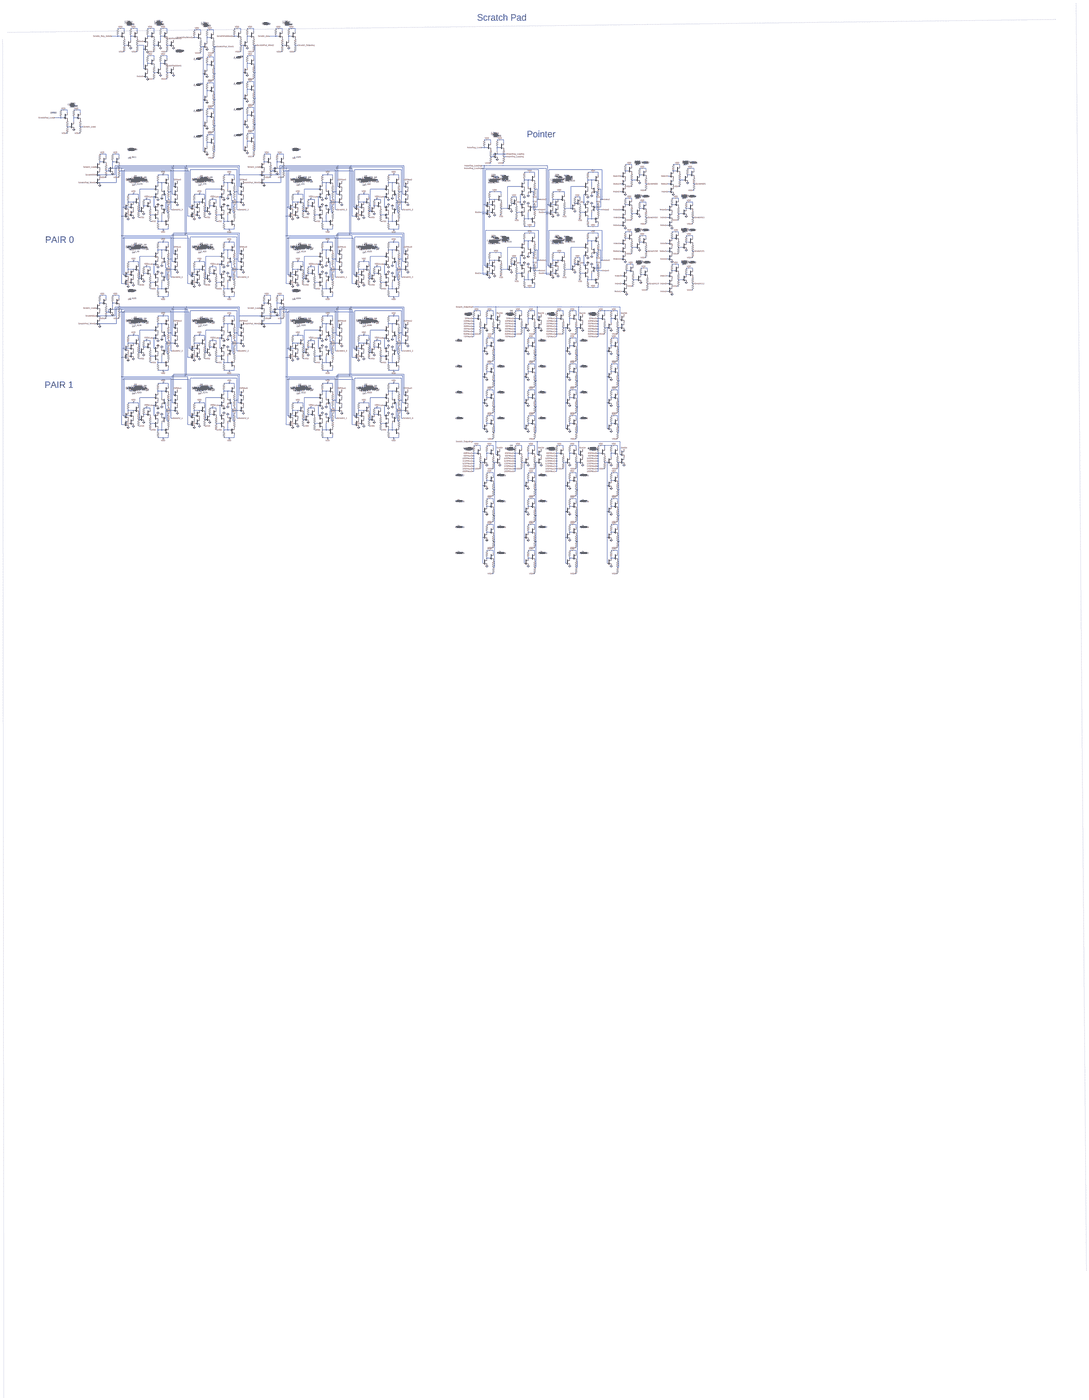
[diagram p0: schematic 4.asc, whole sheet]
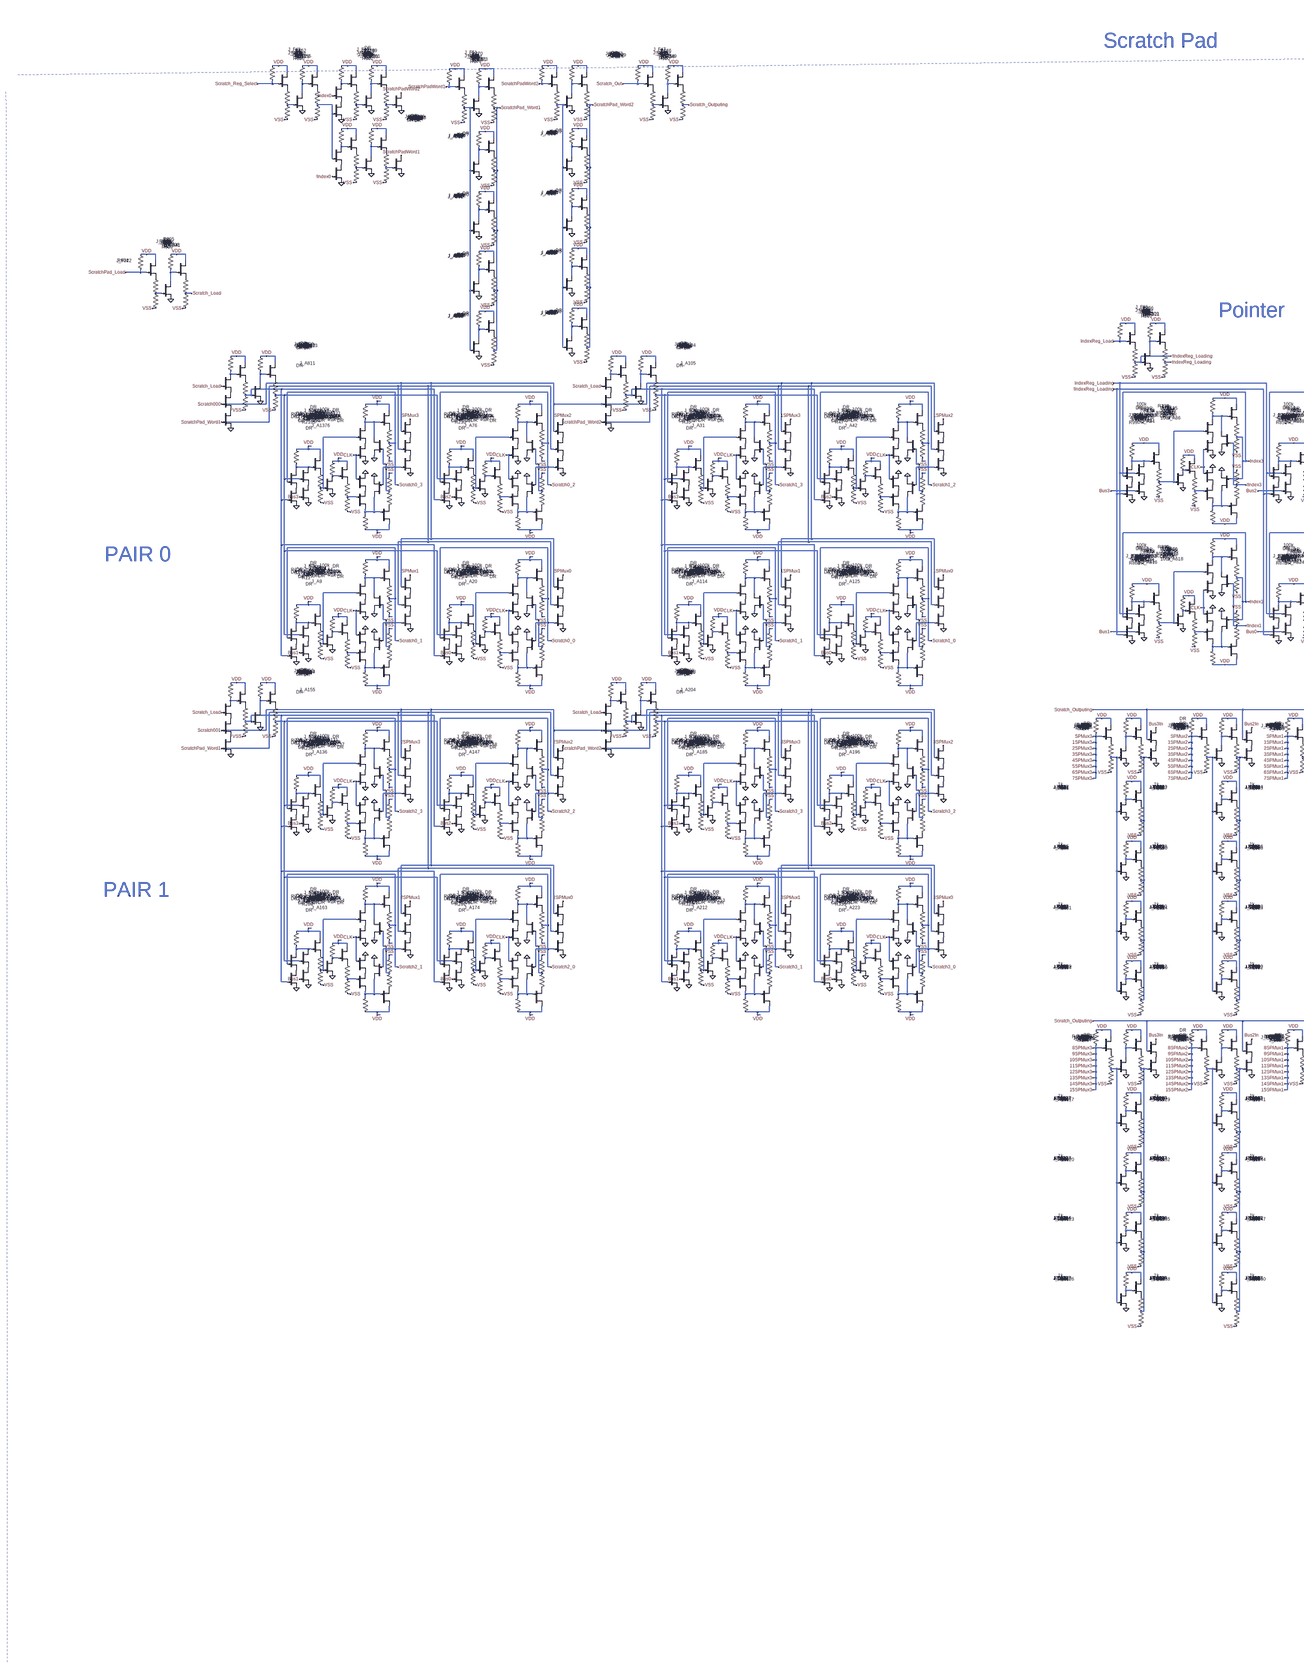
[diagram p1: schematic 4.asc, part, row 1 of 2, column 1 of 2]
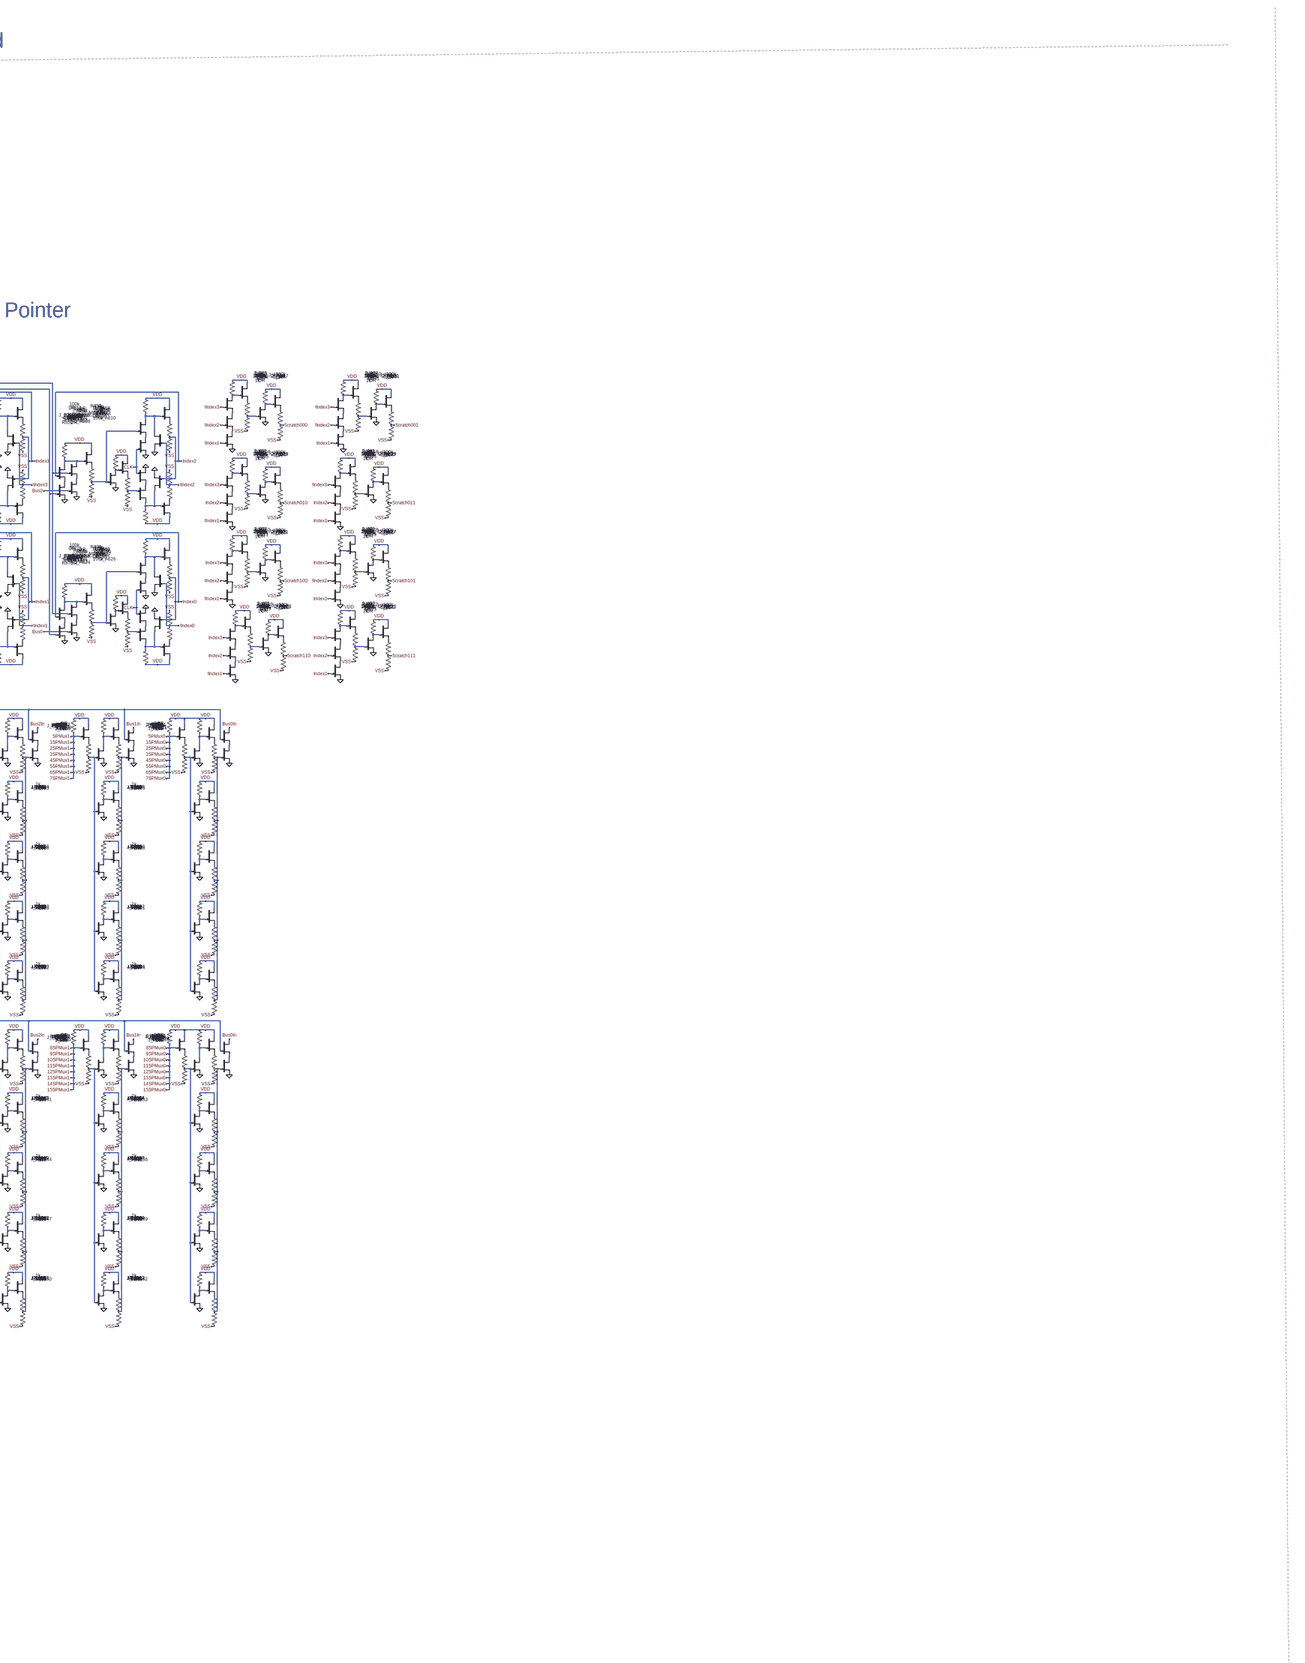
[diagram p2: schematic 4.asc, part, row 1 of 2, column 2 of 2]
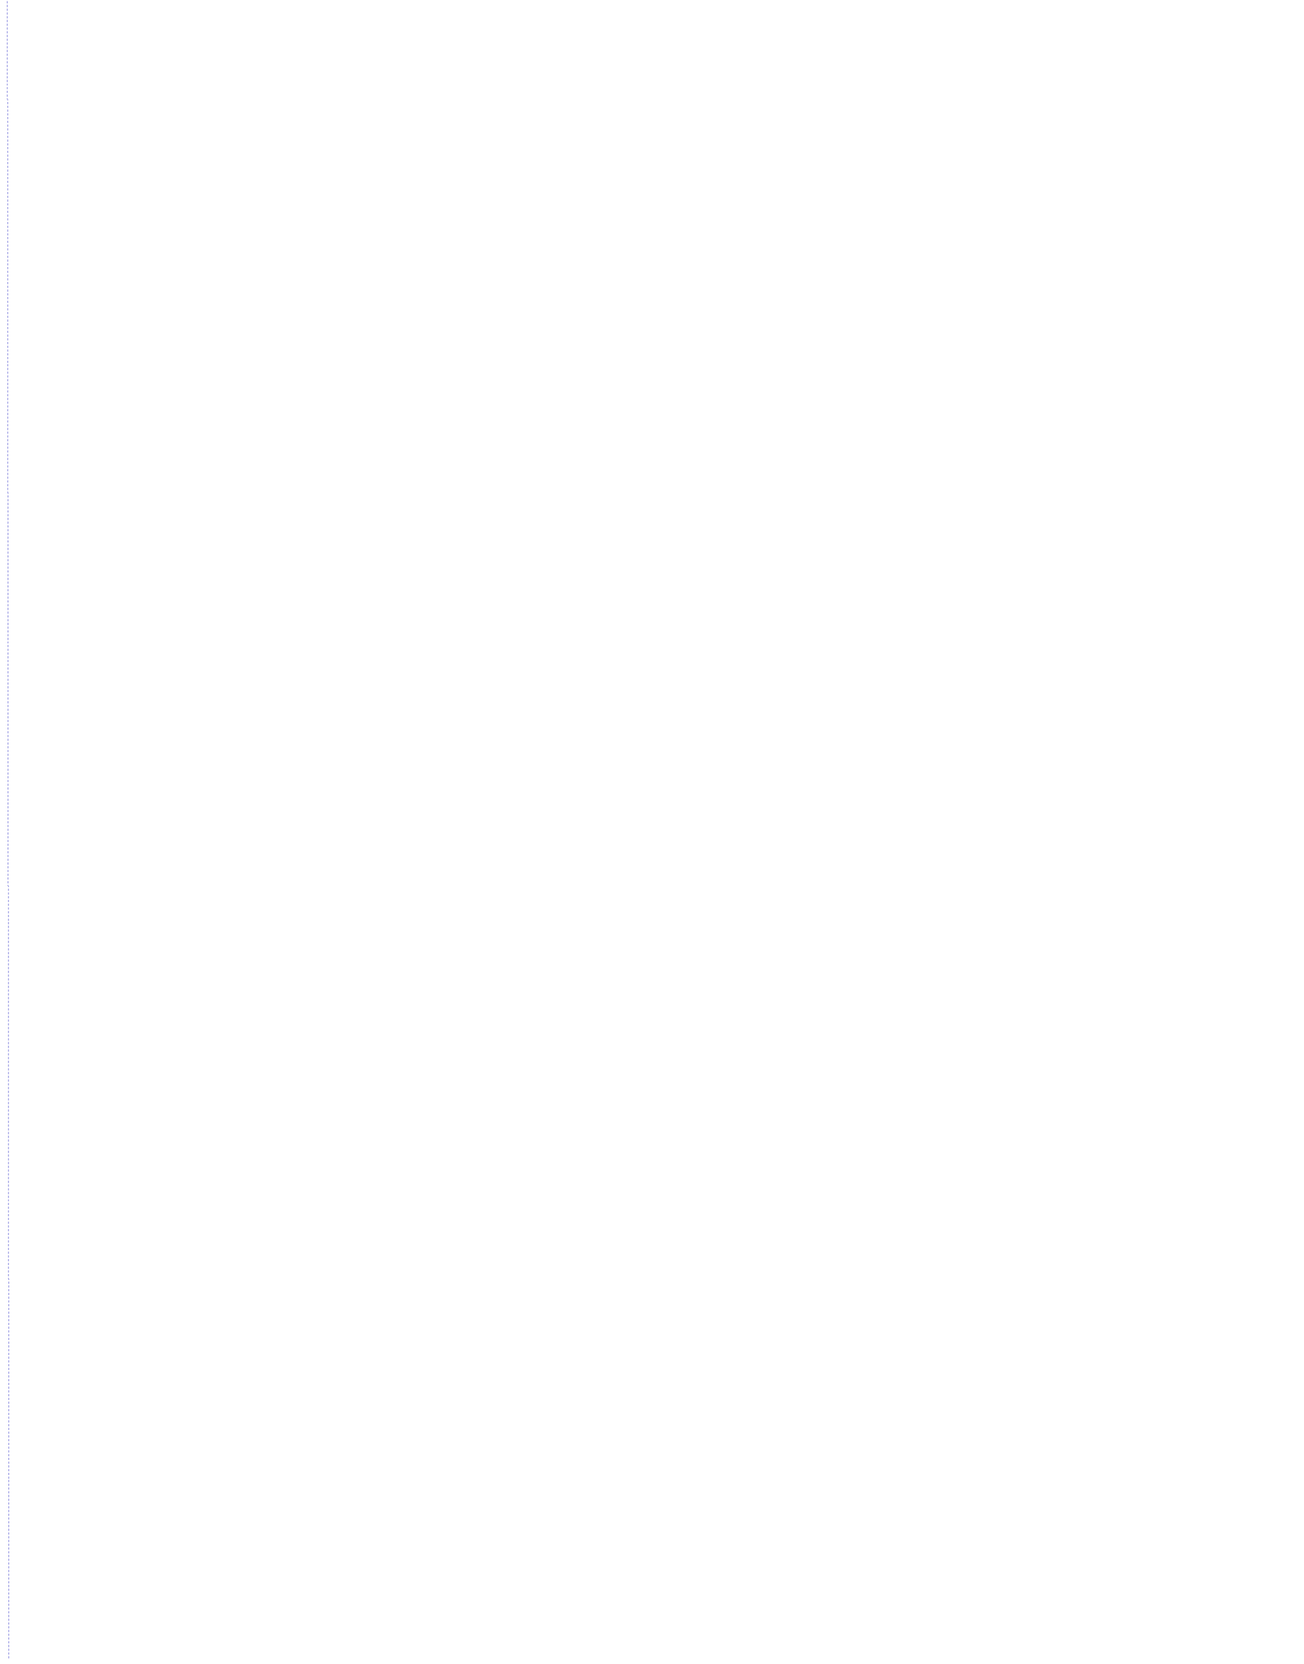
[diagram p3: schematic 4.asc, part, row 2 of 2, column 1 of 2]
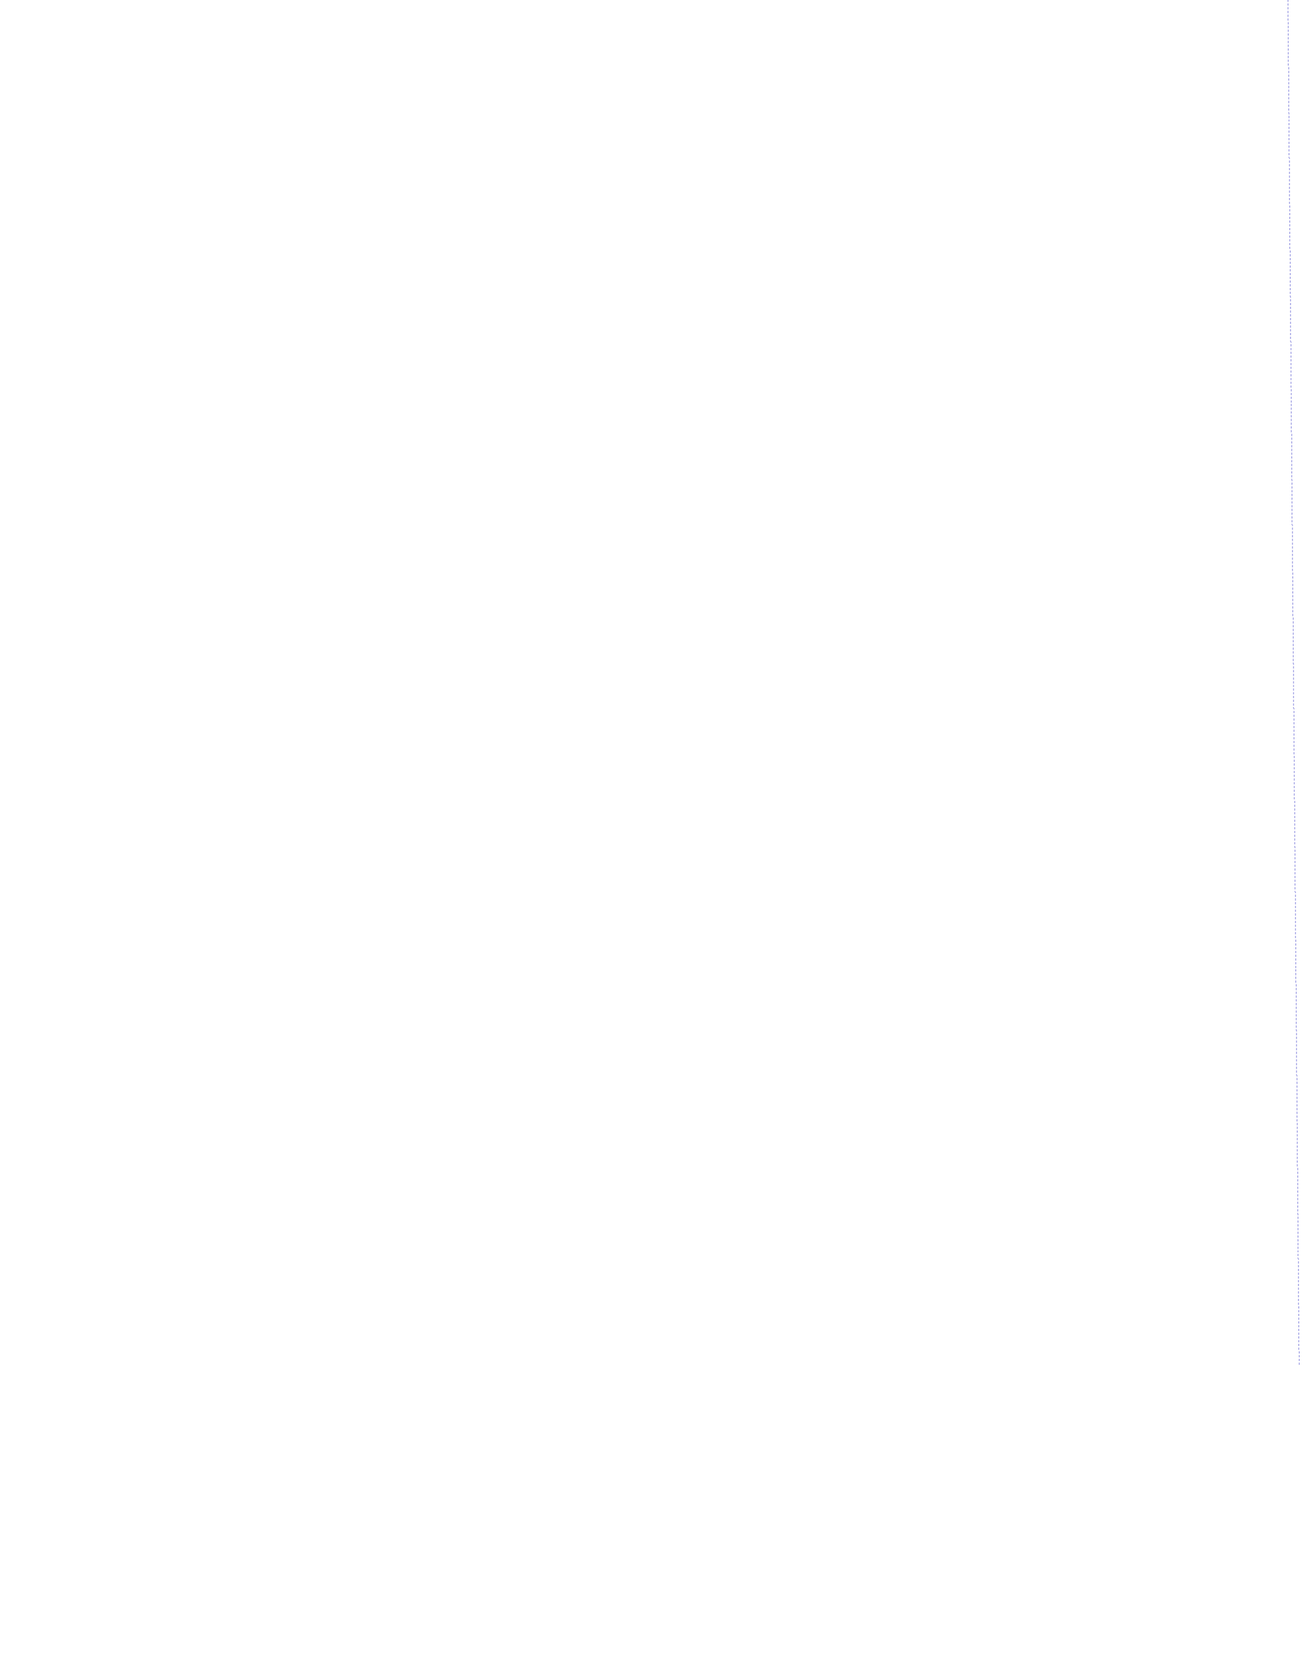
[diagram p4: schematic 4.asc, part, row 2 of 2, column 2 of 2]
* 4.asc
J_A1369 N045 N051 P001 DR
R2125 VDD N045 100k
J_F510 VDD N045 P002 DR
R2126 P002 Scratch0_3 1k
R2127 Scratch0_3 VSS 4.8k
J_B634 N045 N057 0 DR
J_A1370 N085 N079 P003 DR
R2128 VDD N085 100k
J_F511 VDD N085 P004 DR
R2129 P004 N057 1k
R2130 N057 VSS 4.8k
J_B635 N085 Scratch0_3 0 DR
J_A1371 P001 CLK 0 DR
J_A1372 P003 CLK 0 DR
J_A1373 N061 Scratch0_3 P005 DR
R2131 VDD N061 100k
J_F512 VDD N061 P006 DR
R2132 P006 N051 1k
R2133 N051 VSS 4.8k
J_B636 N061 N035 P007 DR
J_A1374 N069 N051 0 DR
R2134 VDD N069 50k
J_A1375 VDD N069 P008 DR
R2135 P008 N079 1k
R2136 N079 VSS 4.5k
J_A1376 P005 N033 0 DR
J_B637 P007 Bus3 0 DR
J_A64 P009 Scratch0_3 0 DR
J_A65 P010 ScratchPad_Word1 P009 DR
J_A66 7SPMux3 Scratch000 P010 DR
J_A1 N046 N052 P011 DR
R223 VDD N046 100k
J_F32 VDD N046 P012 DR
R224 P012 Scratch0_2 1k
R225 Scratch0_2 VSS 4.8k
J_B38 N046 N058 0 DR
J_A70 N086 N080 P013 DR
R226 VDD N086 100k
J_F64 VDD N086 P014 DR
R227 P014 N058 1k
R228 N058 VSS 4.8k
J_B39 N086 Scratch0_2 0 DR
J_A71 P011 CLK 0 DR
J_A72 P013 CLK 0 DR
J_A73 N062 Scratch0_2 P015 DR
R229 VDD N062 100k
J_F65 VDD N062 P016 DR
R230 P016 N052 1k
R231 N052 VSS 4.8k
J_B40 N062 N035 P017 DR
J_A74 N070 N052 0 DR
R232 VDD N070 50k
J_A75 VDD N070 P018 DR
R233 P018 N080 1k
R234 N080 VSS 4.5k
J_A76 P015 N033 0 DR
J_B41 P017 Bus2 0 DR
J_A77 P019 Scratch0_2 0 DR
J_A78 P020 ScratchPad_Word1 P019 DR
J_A286 7SPMux2 Scratch000 P020 DR
J_A48 N041 N049 P021 DR
R97 VDD N041 100k
J_F78 VDD N041 P022 DR
R98 P022 Index3 1k
R99 Index3 VSS 4.8k
J_B32 N041 !Index3 0 DR
J_A49 N083 N075 P023 DR
R100 VDD N083 100k
J_F79 VDD N083 P024 DR
R101 P024 !Index3 1k
R102 !Index3 VSS 4.8k
J_B33 N083 Index3 0 DR
J_A84 P021 CLK 0 DR
J_A85 P023 CLK 0 DR
J_A86 N055 Index3 P025 DR
R193 VDD N055 100k
J_F80 VDD N055 P026 DR
R194 P026 N049 1k
R195 N049 VSS 4.8k
J_B34 N055 IndexReg_Loading P027 DR
J_A87 N065 N049 0 DR
R196 VDD N065 50k
J_A92 VDD N065 P028 DR
R197 P028 N075 1k
R198 N075 VSS 4.5k
J_A93 P025 !IndexReg_Loading 0 DR
J_B35 P027 Bus3 0 DR
J_A606 N042 N050 P029 DR
R850 VDD N042 100k
J_F209 VDD N042 P030 DR
R851 P030 Index2 1k
R852 Index2 VSS 4.8k
J_B249 N042 !Index2 0 DR
J_A607 N084 N076 P031 DR
R853 VDD N084 100k
J_F210 VDD N084 P032 DR
R854 P032 !Index2 1k
R855 !Index2 VSS 4.8k
J_B250 N084 Index2 0 DR
J_A608 P029 CLK 0 DR
J_A609 P031 CLK 0 DR
J_A610 N056 Index2 P033 DR
R856 VDD N056 100k
J_F211 VDD N056 P034 DR
R857 P034 N050 1k
R858 N050 VSS 4.8k
J_B251 N056 IndexReg_Loading P035 DR
J_A611 N066 N050 0 DR
R859 VDD N066 50k
J_A612 VDD N066 P036 DR
R860 P036 N076 1k
R861 N076 VSS 4.5k
J_A613 P033 !IndexReg_Loading 0 DR
J_B252 P035 Bus2 0 DR
J_A614 N091 N095 P037 DR
R862 VDD N091 100k
J_F212 VDD N091 P038 DR
R863 P038 Index1 1k
R864 Index1 VSS 4.8k
J_B253 N091 !Index1 0 DR
J_A615 N129 N125 P039 DR
R865 VDD N129 100k
J_F213 VDD N129 P040 DR
R866 P040 !Index1 1k
R867 !Index1 VSS 4.8k
J_B254 N129 Index1 0 DR
J_A616 P037 CLK 0 DR
J_A617 P039 CLK 0 DR
J_A618 N107 Index1 P041 DR
R868 VDD N107 100k
J_F214 VDD N107 P042 DR
R869 P042 N095 1k
R870 N095 VSS 4.8k
J_B255 N107 IndexReg_Loading P043 DR
J_A619 N109 N095 0 DR
R871 VDD N109 50k
J_A620 VDD N109 P044 DR
R872 P044 N125 1k
R873 N125 VSS 4.5k
J_A621 P041 !IndexReg_Loading 0 DR
J_B256 P043 Bus1 0 DR
J_A622 N092 N096 P045 DR
R874 VDD N092 100k
J_F215 VDD N092 P046 DR
R875 P046 Index0 1k
R876 Index0 VSS 4.8k
J_B257 N092 !Index0 0 DR
J_A623 N130 N126 P047 DR
R877 VDD N130 100k
J_F216 VDD N130 P048 DR
R878 P048 !Index0 1k
R879 !Index0 VSS 4.8k
J_B258 N130 Index0 0 DR
J_A624 P045 CLK 0 DR
J_A625 P047 CLK 0 DR
J_A626 N108 Index0 P049 DR
R880 VDD N108 100k
J_F217 VDD N108 P050 DR
R881 P050 N096 1k
R882 N096 VSS 4.8k
J_B259 N108 IndexReg_Loading P051 DR
J_A627 N110 N096 0 DR
R883 VDD N110 50k
J_A628 VDD N110 P052 DR
R884 P052 N126 1k
R885 N126 VSS 4.5k
J_A629 P049 !IndexReg_Loading 0 DR
J_B260 P051 Bus0 0 DR
R904 VDD ScratchPad_Load 100k
J_F222 VDD ScratchPad_Load P053 DR
R905 P053 N025 1k
R906 N025 VSS 4.8k
J_A640 N024 N025 0 DR
R907 VDD N024 50k
J_A641 VDD N024 P054 DR
R908 P054 Scratch_Load 1k
R909 VSS Scratch_Load 4.5k
J_A44 N037 !Index3 P055 DR
R85 VDD N037 100k
J_F29 VDD N037 P056 DR
R86 P056 N043 1k
R87 N043 VSS 4.8k
J_B16 P055 !Index2 P057 DR
J_A45 N039 N043 0 DR
R88 VDD N039 50k
J_F30 VDD N039 P058 DR
R89 P058 Scratch000 1k
R90 VSS Scratch000 4.5k
J_B17 P057 !Index1 0 DR
J_A50 N067 !Index3 P059 DR
R103 VDD N067 100k
J_F33 VDD N067 P060 DR
R104 P060 N077 1k
R105 N077 VSS 4.8k
J_B18 P059 Index2 P061 DR
J_A51 N073 N077 0 DR
R106 VDD N073 50k
J_F34 VDD N073 P062 DR
R107 P062 Scratch010 1k
R108 VSS Scratch010 4.5k
J_B19 P061 !Index1 0 DR
J_A52 N089 Index3 P063 DR
R109 VDD N089 100k
J_F35 VDD N089 P064 DR
R110 P064 N097 1k
R111 N097 VSS 4.8k
J_B20 P063 !Index2 P065 DR
J_A53 N093 N097 0 DR
R112 VDD N093 50k
J_F36 VDD N093 P066 DR
R113 P066 Scratch100 1k
R114 VSS Scratch100 4.5k
J_B21 P065 !Index1 0 DR
J_A54 N119 Index3 P067 DR
R115 VDD N119 100k
J_F37 VDD N119 P068 DR
R116 P068 N131 1k
R117 N131 VSS 4.8k
J_B22 P067 Index2 P069 DR
J_A55 N127 N131 0 DR
R118 VDD N127 50k
J_F38 VDD N127 P070 DR
R119 P070 Scratch110 1k
R120 VSS Scratch110 4.5k
J_B23 P069 !Index1 0 DR
J_A56 N120 Index3 P071 DR
R121 VDD N120 100k
J_F39 VDD N120 P072 DR
R122 P072 N132 1k
R123 N132 VSS 4.8k
J_B24 P071 Index2 P073 DR
J_A57 N128 N132 0 DR
R124 VDD N128 50k
J_F40 VDD N128 P074 DR
R125 P074 Scratch111 1k
R126 VSS Scratch111 4.5k
J_B25 P073 Index1 0 DR
J_A58 N090 Index3 P075 DR
R127 VDD N090 100k
J_F41 VDD N090 P076 DR
R128 P076 N098 1k
R129 N098 VSS 4.8k
J_B26 P075 !Index2 P077 DR
J_A59 N094 N098 0 DR
R130 VDD N094 50k
J_F42 VDD N094 P078 DR
R131 P078 Scratch101 1k
R132 VSS Scratch101 4.5k
J_B27 P077 Index1 0 DR
J_A60 N068 !Index3 P079 DR
R133 VDD N068 100k
J_F43 VDD N068 P080 DR
R134 P080 N078 1k
R135 N078 VSS 4.8k
J_B28 P079 Index2 P081 DR
J_A61 N074 N078 0 DR
R136 VDD N074 50k
J_F44 VDD N074 P082 DR
R137 P082 Scratch011 1k
R138 VSS Scratch011 4.5k
J_B29 P081 Index1 0 DR
J_A62 N038 !Index3 P083 DR
R139 VDD N038 100k
J_F45 VDD N038 P084 DR
R140 P084 N044 1k
R141 N044 VSS 4.8k
J_B30 P083 !Index2 P085 DR
J_A63 N040 N044 0 DR
R142 VDD N040 50k
J_F46 VDD N040 P086 DR
R143 P086 Scratch001 1k
R144 VSS Scratch001 4.5k
J_B31 P085 Index1 0 DR
R145 VDD Scratch_Out 100k
J_F47 VDD Scratch_Out P087 DR
R146 P087 N012 1k
R147 N012 VSS 4.8k
J_A67 N005 N012 0 DR
R148 VDD N005 50k
J_A68 VDD N005 P088 DR
R149 P088 Scratch_Outputing 1k
R150 VSS Scratch_Outputing 4.5k
R151 VDD Scratch_Reg_Select 100k
J_F48 VDD Scratch_Reg_Select P089 DR
R152 P089 N007 1k
R153 N007 VSS 4.8k
J_A69 N001 N007 0 DR
R154 VDD N001 50k
J_A79 VDD N001 P090 DR
R155 P090 N008 1k
R156 VSS N008 4.5k
R157 VDD N002 100k
J_F49 VDD N002 P091 DR
R158 P091 N009 1k
R159 N009 VSS 4.8k
J_A82 N003 N009 0 DR
R160 VDD N003 50k
J_A83 VDD N003 P092 DR
R161 P092 N010 1k
R162 VSS N010 4.5k
J_A793 N002 Index0 P093 DR
J_A794 P093 N008 0 DR
R163 VDD N014 100k
J_F50 VDD N014 P094 DR
R164 P094 N018 1k
R165 N018 VSS 4.8k
J_A795 N015 N018 0 DR
R166 VDD N015 50k
J_A796 VDD N015 P095 DR
R167 P095 N019 1k
R168 VSS N019 4.5k
J_A797 N014 N008 P096 DR
J_A798 P096 !Index0 0 DR
J_A799 ScratchPadWord2 N010 0 DR
J_A800 ScratchPadWord1 N019 0 DR
R169 VDD ScratchPadWord1 100k
J_F51 VDD ScratchPadWord1 P097 DR
R170 P097 N013 1k
R171 N013 VSS 4.8k
J_A80 N006 N013 0 DR
R172 VDD N006 50k
J_A81 VDD N006 P098 DR
R173 P098 ScratchPad_Word1 1k
R174 VSS ScratchPad_Word1 4.5k
R175 VDD ScratchPadWord2 100k
J_F52 VDD ScratchPadWord2 P099 DR
R176 P099 N011 1k
R177 N011 VSS 4.8k
J_A96 N004 N011 0 DR
R178 VDD N004 50k
J_A97 VDD N004 P100 DR
R179 P100 ScratchPad_Word2 1k
R180 VSS ScratchPad_Word2 4.5k
R205 VDD IndexReg_Load 100k
J_F86 VDD IndexReg_Load P101 DR
R206 P101 !IndexReg_Loading 1k
R207 !IndexReg_Loading VSS 4.8k
J_A102 N028 !IndexReg_Loading 0 DR
R208 VDD N028 50k
J_A111 VDD N028 P102 DR
R209 P102 IndexReg_Loading 1k
R210 VSS IndexReg_Loading 4.5k
R200 VDD 7SPMux3 100k
J_F58 VDD 7SPMux3 P103 DR
R201 P103 N157 1k
R203 N157 VSS 4.8k
J_A100 N149 N157 0 DR
R204 VDD N149 50k
J_A101 VDD N149 P104 DR
R211 P104 N158 1k
R212 VSS N158 4.5k
J_F59 P105 N158 0 DR
R213 VDD 7SPMux2 100k
J_F60 VDD 7SPMux2 P106 DR
R214 P106 N159 1k
R215 N159 VSS 4.8k
J_A280 N150 N159 0 DR
R216 VDD N150 50k
J_A281 VDD N150 P107 DR
R217 P107 N160 1k
R218 VSS N160 4.5k
J_F61 P108 N160 0 DR
R219 VDD 7SPMux1 100k
J_F62 VDD 7SPMux1 P109 DR
R220 P109 N161 1k
R221 N161 VSS 4.8k
J_A282 N151 N161 0 DR
R222 VDD N151 50k
J_A283 VDD N151 P110 DR
R898 P110 N162 1k
R899 VSS N162 4.5k
J_F63 P111 N162 0 DR
R900 VDD 7SPMux0 100k
J_F71 VDD 7SPMux0 P112 DR
R901 P112 N163 1k
R902 N163 VSS 4.8k
J_A284 N152 N163 0 DR
R903 VDD N152 50k
J_A285 VDD N152 P113 DR
R911 P113 N164 1k
R912 VSS N164 4.5k
J_F82 P114 N164 0 DR
J_F266 Bus3In Scratch_Outputing P105 DR
J_F267 Bus2In Scratch_Outputing P108 DR
J_F268 Bus1In Scratch_Outputing P111 DR
J_F269 Bus0In Scratch_Outputing P114 DR
R199 VDD N029 100k
J_F270 VDD N029 P115 DR
R202 P115 N033 1k
R910 N033 VSS 4.8k
J_A807 N030 N033 0 DR
R913 VDD N030 50k
J_A808 VDD N030 P116 DR
R1023 P116 N035 1k
R1024 VSS N035 4.5k
J_A809 N029 Scratch_Load P117 DR
J_A810 P117 Scratch000 P118 DR
J_A811 P118 ScratchPad_Word1 0 DR
J_A2 N099 N103 P119 DR
R1 VDD N099 100k
J_F1 VDD N099 P120 DR
R2 P120 Scratch0_1 1k
R3 Scratch0_1 VSS 4.8k
J_B1 N099 N111 0 DR
J_A3 N137 N133 P121 DR
R4 VDD N137 100k
J_F2 VDD N137 P122 DR
R5 P122 N111 1k
R6 N111 VSS 4.8k
J_B2 N137 Scratch0_1 0 DR
J_A4 P119 CLK 0 DR
J_A5 P121 CLK 0 DR
J_A6 N115 Scratch0_1 P123 DR
R7 VDD N115 100k
J_F3 VDD N115 P124 DR
R8 P124 N103 1k
R9 N103 VSS 4.8k
J_B3 N115 N035 P125 DR
J_A7 N121 N103 0 DR
R10 VDD N121 50k
J_A8 VDD N121 P126 DR
R11 P126 N133 1k
R12 N133 VSS 4.5k
J_A9 P123 N033 0 DR
J_B4 P125 Bus1 0 DR
J_A10 P127 Scratch0_1 0 DR
J_A11 P128 ScratchPad_Word1 P127 DR
J_A12 7SPMux1 Scratch000 P128 DR
J_A13 N100 N104 P129 DR
R13 VDD N100 100k
J_F4 VDD N100 P130 DR
R14 P130 Scratch0_0 1k
R15 Scratch0_0 VSS 4.8k
J_B5 N100 N112 0 DR
J_A14 N138 N134 P131 DR
R16 VDD N138 100k
J_F5 VDD N138 P132 DR
R17 P132 N112 1k
R18 N112 VSS 4.8k
J_B6 N138 Scratch0_0 0 DR
J_A15 P129 CLK 0 DR
J_A16 P131 CLK 0 DR
J_A17 N116 Scratch0_0 P133 DR
R19 VDD N116 100k
J_F6 VDD N116 P134 DR
R20 P134 N104 1k
R21 N104 VSS 4.8k
J_B7 N116 N035 P135 DR
J_A18 N122 N104 0 DR
R22 VDD N122 50k
J_A19 VDD N122 P136 DR
R23 P136 N134 1k
R24 N134 VSS 4.5k
J_A20 P133 N033 0 DR
J_B8 P135 Bus0 0 DR
J_A21 P137 Scratch0_0 0 DR
J_A22 P138 ScratchPad_Word1 P137 DR
J_A23 7SPMux0 Scratch000 P138 DR
J_A24 N047 N053 P139 DR
R25 VDD N047 100k
J_F7 VDD N047 P140 DR
R26 P140 Scratch1_3 1k
R27 Scratch1_3 VSS 4.8k
J_B9 N047 N059 0 DR
J_A25 N087 N081 P141 DR
R28 VDD N087 100k
J_F8 VDD N087 P142 DR
R29 P142 N059 1k
R30 N059 VSS 4.8k
J_B10 N087 Scratch1_3 0 DR
J_A26 P139 CLK 0 DR
J_A27 P141 CLK 0 DR
J_A28 N063 Scratch1_3 P143 DR
R31 VDD N063 100k
J_F9 VDD N063 P144 DR
R32 P144 N053 1k
R33 N053 VSS 4.8k
J_B11 N063 N036 P145 DR
J_A29 N071 N053 0 DR
R34 VDD N071 50k
J_A30 VDD N071 P146 DR
R35 P146 N081 1k
R36 N081 VSS 4.5k
J_A31 P143 N034 0 DR
J_B12 P145 Bus3 0 DR
J_A32 P147 Scratch1_3 0 DR
J_A33 P148 ScratchPad_Word2 P147 DR
J_A34 7SPMux3 Scratch000 P148 DR
J_A35 N048 N054 P149 DR
R37 VDD N048 100k
J_F10 VDD N048 P150 DR
R38 P150 Scratch1_2 1k
R39 Scratch1_2 VSS 4.8k
J_B13 N048 N060 0 DR
J_A36 N088 N082 P151 DR
R40 VDD N088 100k
J_F11 VDD N088 P152 DR
R41 P152 N060 1k
R42 N060 VSS 4.8k
J_B14 N088 Scratch1_2 0 DR
J_A37 P149 CLK 0 DR
J_A38 P151 CLK 0 DR
J_A39 N064 Scratch1_2 P153 DR
R43 VDD N064 100k
J_F12 VDD N064 P154 DR
R44 P154 N054 1k
R45 N054 VSS 4.8k
J_B15 N064 N036 P155 DR
J_A40 N072 N054 0 DR
R46 VDD N072 50k
J_A41 VDD N072 P156 DR
R47 P156 N082 1k
R48 N082 VSS 4.5k
J_A42 P153 N034 0 DR
J_B36 P155 Bus2 0 DR
J_A43 P157 Scratch1_2 0 DR
J_A88 P158 ScratchPad_Word2 P157 DR
J_A89 7SPMux2 Scratch000 P158 DR
R49 VDD N031 100k
J_F13 VDD N031 P159 DR
R50 P159 N034 1k
R51 N034 VSS 4.8k
J_A90 N032 N034 0 DR
R52 VDD N032 50k
J_A91 VDD N032 P160 DR
R53 P160 N036 1k
R54 VSS N036 4.5k
J_A103 N031 Scratch_Load P161 DR
J_A104 P161 Scratch000 P162 DR
J_A105 P162 ScratchPad_Word2 0 DR
J_A106 N101 N105 P163 DR
R55 VDD N101 100k
J_F14 VDD N101 P164 DR
R56 P164 Scratch1_1 1k
R57 Scratch1_1 VSS 4.8k
J_B37 N101 N113 0 DR
J_A107 N139 N135 P165 DR
R58 VDD N139 100k
J_F15 VDD N139 P166 DR
R59 P166 N113 1k
R60 N113 VSS 4.8k
J_B42 N139 Scratch1_1 0 DR
J_A108 P163 CLK 0 DR
J_A109 P165 CLK 0 DR
J_A110 N117 Scratch1_1 P167 DR
R61 VDD N117 100k
J_F16 VDD N117 P168 DR
R62 P168 N105 1k
R63 N105 VSS 4.8k
J_B43 N117 N036 P169 DR
J_A112 N123 N105 0 DR
R64 VDD N123 50k
J_A113 VDD N123 P170 DR
R65 P170 N135 1k
R66 N135 VSS 4.5k
J_A114 P167 N034 0 DR
J_B44 P169 Bus1 0 DR
J_A115 P171 Scratch1_1 0 DR
J_A116 P172 ScratchPad_Word2 P171 DR
J_A117 7SPMux1 Scratch000 P172 DR
J_A118 N102 N106 P173 DR
R67 VDD N102 100k
J_F17 VDD N102 P174 DR
R68 P174 Scratch1_0 1k
R69 Scratch1_0 VSS 4.8k
J_B45 N102 N114 0 DR
J_A119 N140 N136 P175 DR
R70 VDD N140 100k
J_F18 VDD N140 P176 DR
R71 P176 N114 1k
R72 N114 VSS 4.8k
J_B46 N140 Scratch1_0 0 DR
J_A120 P173 CLK 0 DR
J_A121 P175 CLK 0 DR
J_A122 N118 Scratch1_0 P177 DR
R73 VDD N118 100k
J_F19 VDD N118 P178 DR
R74 P178 N106 1k
R75 N106 VSS 4.8k
J_B47 N118 N036 P179 DR
J_A123 N124 N106 0 DR
R76 VDD N124 50k
J_A124 VDD N124 P180 DR
R77 P180 N136 1k
R78 N136 VSS 4.5k
J_A125 P177 N034 0 DR
J_B48 P179 Bus0 0 DR
J_A126 P181 Scratch1_0 0 DR
J_A127 P182 ScratchPad_Word2 P181 DR
J_A128 7SPMux0 Scratch000 P182 DR
J_A129 N153 N165 P183 DR
R79 VDD N153 100k
J_F20 VDD N153 P184 DR
R80 P184 Scratch2_3 1k
R81 Scratch2_3 VSS 4.8k
J_B49 N153 N169 0 DR
J_A130 N189 N185 P185 DR
R82 VDD N189 100k
J_F21 VDD N189 P186 DR
R83 P186 N169 1k
R84 N169 VSS 4.8k
J_B50 N189 Scratch2_3 0 DR
J_A131 P183 CLK 0 DR
J_A132 P185 CLK 0 DR
J_A133 N173 Scratch2_3 P187 DR
R235 VDD N173 100k
J_F22 VDD N173 P188 DR
R236 P188 N165 1k
R237 N165 VSS 4.8k
J_B51 N173 N147 P189 DR
J_A134 N181 N165 0 DR
R238 VDD N181 50k
J_A135 VDD N181 P190 DR
R239 P190 N185 1k
R240 N185 VSS 4.5k
J_A136 P187 N145 0 DR
J_B52 P189 Bus3 0 DR
J_A137 P191 Scratch2_3 0 DR
J_A138 P192 ScratchPad_Word1 P191 DR
J_A139 7SPMux3 Scratch001 P192 DR
J_A140 N154 N166 P193 DR
R241 VDD N154 100k
J_F23 VDD N154 P194 DR
R242 P194 Scratch2_2 1k
R243 Scratch2_2 VSS 4.8k
J_B53 N154 N170 0 DR
J_A141 N190 N186 P195 DR
R244 VDD N190 100k
J_F24 VDD N190 P196 DR
R245 P196 N170 1k
R246 N170 VSS 4.8k
J_B54 N190 Scratch2_2 0 DR
J_A142 P193 CLK 0 DR
J_A143 P195 CLK 0 DR
J_A144 N174 Scratch2_2 P197 DR
R247 VDD N174 100k
J_F25 VDD N174 P198 DR
R248 P198 N166 1k
R249 N166 VSS 4.8k
J_B55 N174 N147 P199 DR
J_A145 N182 N166 0 DR
R250 VDD N182 50k
J_A146 VDD N182 P200 DR
R251 P200 N186 1k
R252 N186 VSS 4.5k
J_A147 P197 N145 0 DR
J_B56 P199 Bus2 0 DR
J_A148 P201 Scratch2_2 0 DR
J_A149 P202 ScratchPad_Word1 P201 DR
J_A150 7SPMux2 Scratch001 P202 DR
R253 VDD N141 100k
J_F26 VDD N141 P203 DR
R254 P203 N145 1k
R255 N145 VSS 4.8k
J_A151 N142 N145 0 DR
R256 VDD N142 50k
J_A152 VDD N142 P204 DR
R257 P204 N147 1k
R258 VSS N147 4.5k
J_A153 N141 Scratch_Load P205 DR
J_A154 P205 Scratch001 P206 DR
J_A155 P206 ScratchPad_Word1 0 DR
J_A156 N197 N201 P207 DR
R259 VDD N197 100k
J_F27 VDD N197 P208 DR
R260 P208 Scratch2_1 1k
R261 Scratch2_1 VSS 4.8k
J_B57 N197 N209 0 DR
J_A157 N229 N221 P209 DR
R262 VDD N229 100k
J_F28 VDD N229 P210 DR
R263 P210 N209 1k
R264 N209 VSS 4.8k
J_B58 N229 Scratch2_1 0 DR
J_A158 P207 CLK 0 DR
J_A159 P209 CLK 0 DR
J_A160 N213 Scratch2_1 P211 DR
R265 VDD N213 100k
J_F66 VDD N213 P212 DR
R266 P212 N201 1k
R267 N201 VSS 4.8k
J_B59 N213 N147 P213 DR
J_A161 N217 N201 0 DR
R268 VDD N217 50k
J_A162 VDD N217 P214 DR
R269 P214 N221 1k
R270 N221 VSS 4.5k
J_A163 P211 N145 0 DR
J_B60 P213 Bus1 0 DR
J_A164 P215 Scratch2_1 0 DR
J_A165 P216 ScratchPad_Word1 P215 DR
J_A166 7SPMux1 Scratch001 P216 DR
J_A167 N198 N202 P217 DR
R271 VDD N198 100k
J_F67 VDD N198 P218 DR
R272 P218 Scratch2_0 1k
R273 Scratch2_0 VSS 4.8k
J_B61 N198 N210 0 DR
J_A168 N230 N222 P219 DR
R274 VDD N230 100k
J_F68 VDD N230 P220 DR
R275 P220 N210 1k
R276 N210 VSS 4.8k
J_B62 N230 Scratch2_0 0 DR
J_A169 P217 CLK 0 DR
J_A170 P219 CLK 0 DR
J_A171 N214 Scratch2_0 P221 DR
R277 VDD N214 100k
J_F69 VDD N214 P222 DR
R278 P222 N202 1k
R279 N202 VSS 4.8k
J_B63 N214 N147 P223 DR
J_A172 N218 N202 0 DR
R280 VDD N218 50k
J_A173 VDD N218 P224 DR
R281 P224 N222 1k
R282 N222 VSS 4.5k
J_A174 P221 N145 0 DR
J_B64 P223 Bus0 0 DR
J_A175 P225 Scratch2_0 0 DR
J_A176 P226 ScratchPad_Word1 P225 DR
J_A177 7SPMux0 Scratch001 P226 DR
J_A178 N155 N167 P227 DR
R283 VDD N155 100k
J_F70 VDD N155 P228 DR
R284 P228 Scratch3_3 1k
R285 Scratch3_3 VSS 4.8k
J_B65 N155 N171 0 DR
J_A179 N191 N187 P229 DR
R286 VDD N191 100k
J_F72 VDD N191 P230 DR
R287 P230 N171 1k
R288 N171 VSS 4.8k
J_B66 N191 Scratch3_3 0 DR
J_A180 P227 CLK 0 DR
J_A181 P229 CLK 0 DR
J_A182 N175 Scratch3_3 P231 DR
R289 VDD N175 100k
J_F73 VDD N175 P232 DR
R290 P232 N167 1k
R291 N167 VSS 4.8k
J_B67 N175 N148 P233 DR
J_A183 N183 N167 0 DR
R292 VDD N183 50k
J_A184 VDD N183 P234 DR
R293 P234 N187 1k
R294 N187 VSS 4.5k
J_A185 P231 N146 0 DR
J_B68 P233 Bus3 0 DR
J_A186 P235 Scratch3_3 0 DR
J_A187 P236 ScratchPad_Word2 P235 DR
J_A188 7SPMux3 Scratch001 P236 DR
J_A189 N156 N168 P237 DR
R295 VDD N156 100k
J_F74 VDD N156 P238 DR
R296 P238 Scratch3_2 1k
R297 Scratch3_2 VSS 4.8k
J_B69 N156 N172 0 DR
J_A190 N192 N188 P239 DR
R298 VDD N192 100k
J_F75 VDD N192 P240 DR
R299 P240 N172 1k
R300 N172 VSS 4.8k
J_B70 N192 Scratch3_2 0 DR
J_A191 P237 CLK 0 DR
J_A192 P239 CLK 0 DR
J_A193 N176 Scratch3_2 P241 DR
R301 VDD N176 100k
J_F76 VDD N176 P242 DR
R302 P242 N168 1k
R303 N168 VSS 4.8k
J_B71 N176 N148 P243 DR
J_A194 N184 N168 0 DR
R304 VDD N184 50k
J_A195 VDD N184 P244 DR
R305 P244 N188 1k
R306 N188 VSS 4.5k
J_A196 P241 N146 0 DR
J_B72 P243 Bus2 0 DR
J_A197 P245 Scratch3_2 0 DR
J_A198 P246 ScratchPad_Word2 P245 DR
J_A199 7SPMux2 Scratch001 P246 DR
R307 VDD N143 100k
J_F77 VDD N143 P247 DR
R308 P247 N146 1k
R309 N146 VSS 4.8k
J_A200 N144 N146 0 DR
R310 VDD N144 50k
J_A201 VDD N144 P248 DR
R311 P248 N148 1k
R312 VSS N148 4.5k
J_A202 N143 Scratch_Load P249 DR
J_A203 P249 Scratch001 P250 DR
J_A204 P250 ScratchPad_Word2 0 DR
J_A205 N199 N203 P251 DR
R313 VDD N199 100k
J_F81 VDD N199 P252 DR
R314 P252 Scratch3_1 1k
R315 Scratch3_1 VSS 4.8k
J_B73 N199 N211 0 DR
J_A206 N231 N223 P253 DR
R316 VDD N231 100k
J_F85 VDD N231 P254 DR
R317 P254 N211 1k
R318 N211 VSS 4.8k
J_B74 N231 Scratch3_1 0 DR
J_A207 P251 CLK 0 DR
J_A208 P253 CLK 0 DR
J_A209 N215 Scratch3_1 P255 DR
R319 VDD N215 100k
J_F90 VDD N215 P256 DR
R320 P256 N203 1k
R321 N203 VSS 4.8k
J_B75 N215 N148 P257 DR
J_A210 N219 N203 0 DR
R322 VDD N219 50k
J_A211 VDD N219 P258 DR
R323 P258 N223 1k
R324 N223 VSS 4.5k
J_A212 P255 N146 0 DR
J_B76 P257 Bus1 0 DR
J_A213 P259 Scratch3_1 0 DR
J_A214 P260 ScratchPad_Word2 P259 DR
J_A215 7SPMux1 Scratch001 P260 DR
J_A216 N200 N204 P261 DR
R325 VDD N200 100k
J_F91 VDD N200 P262 DR
R326 P262 Scratch3_0 1k
R327 Scratch3_0 VSS 4.8k
J_B77 N200 N212 0 DR
J_A217 N232 N224 P263 DR
R328 VDD N232 100k
J_F92 VDD N232 P264 DR
R329 P264 N212 1k
R330 N212 VSS 4.8k
J_B78 N232 Scratch3_0 0 DR
J_A218 P261 CLK 0 DR
J_A219 P263 CLK 0 DR
J_A220 N216 Scratch3_0 P265 DR
R331 VDD N216 100k
J_F93 VDD N216 P266 DR
R332 P266 N204 1k
R333 N204 VSS 4.8k
J_B79 N216 N148 P267 DR
J_A221 N220 N204 0 DR
R334 VDD N220 50k
J_A222 VDD N220 P268 DR
R335 P268 N224 1k
R336 N224 VSS 4.5k
J_A223 P265 N146 0 DR
J_B80 P267 Bus0 0 DR
J_A224 P269 Scratch3_0 0 DR
J_A225 P270 ScratchPad_Word2 P269 DR
J_A226 7SPMux0 Scratch001 P270 DR
J_A46 N177 N157 0 DR
R91 VDD N177 50k
J_A47 VDD N177 P271 DR
R92 P271 N158 1k
R93 VSS N158 4.5k
J_A94 N193 N157 0 DR
R94 VDD N193 50k
J_A95 VDD N193 P272 DR
R95 P272 N158 1k
R96 VSS N158 4.5k
J_A98 N205 N157 0 DR
R181 VDD N205 50k
J_A99 VDD N205 P273 DR
R182 P273 N158 1k
R183 VSS N158 4.5k
J_A638 N225 N157 0 DR
R184 VDD N225 50k
J_A639 VDD N225 P274 DR
R185 P274 N158 1k
R186 VSS N158 4.5k
J_A642 N178 N159 0 DR
R187 VDD N178 50k
J_A643 VDD N178 P275 DR
R188 P275 N160 1k
R189 VSS N160 4.5k
J_A777 N194 N159 0 DR
R190 VDD N194 50k
J_A778 VDD N194 P276 DR
R191 P276 N160 1k
R192 VSS N160 4.5k
J_A779 N206 N159 0 DR
R914 VDD N206 50k
J_A780 VDD N206 P277 DR
R915 P277 N160 1k
R949 VSS N160 4.5k
J_A781 N226 N159 0 DR
R950 VDD N226 50k
J_A782 VDD N226 P278 DR
R951 P278 N160 1k
R952 VSS N160 4.5k
J_A783 N179 N161 0 DR
R953 VDD N179 50k
J_A784 VDD N179 P279 DR
R954 P279 N162 1k
R955 VSS N162 4.5k
J_A785 N195 N161 0 DR
R956 VDD N195 50k
J_A786 VDD N195 P280 DR
R957 P280 N162 1k
R958 VSS N162 4.5k
J_A787 N207 N161 0 DR
R959 VDD N207 50k
J_A788 VDD N207 P281 DR
R960 P281 N162 1k
R961 VSS N162 4.5k
J_A789 N227 N161 0 DR
R962 VDD N227 50k
J_A790 VDD N227 P282 DR
R963 P282 N162 1k
R964 VSS N162 4.5k
J_A887 N180 N163 0 DR
R965 VDD N180 50k
J_A888 VDD N180 P283 DR
R966 P283 N164 1k
R967 VSS N164 4.5k
J_A889 N196 N163 0 DR
R968 VDD N196 50k
J_A890 VDD N196 P284 DR
R969 P284 N164 1k
R970 VSS N164 4.5k
J_A891 N208 N163 0 DR
R971 VDD N208 50k
J_A892 VDD N208 P285 DR
R972 P285 N164 1k
R973 VSS N164 4.5k
J_A893 N228 N163 0 DR
R974 VDD N228 50k
J_A894 VDD N228 P286 DR
R975 P286 N164 1k
R976 VSS N164 4.5k
J_A791 N017 N013 0 DR
R977 VDD N017 50k
J_A792 VDD N017 P287 DR
R978 P287 ScratchPad_Word1 1k
R979 VSS ScratchPad_Word1 4.5k
J_A801 N021 N013 0 DR
R980 VDD N021 50k
J_A802 VDD N021 P288 DR
R981 P288 ScratchPad_Word1 1k
R982 VSS ScratchPad_Word1 4.5k
J_A803 N023 N013 0 DR
R983 VDD N023 50k
J_A804 VDD N023 P289 DR
R984 P289 ScratchPad_Word1 1k
R985 VSS ScratchPad_Word1 4.5k
J_A805 N027 N013 0 DR
R986 VDD N027 50k
J_A806 VDD N027 P290 DR
R987 P290 ScratchPad_Word1 1k
R988 VSS ScratchPad_Word1 4.5k
J_A895 N016 N011 0 DR
R989 VDD N016 50k
J_A896 VDD N016 P291 DR
R990 P291 ScratchPad_Word2 1k
R991 VSS ScratchPad_Word2 4.5k
J_A897 N020 N011 0 DR
R992 VDD N020 50k
J_A898 VDD N020 P292 DR
R993 P292 ScratchPad_Word2 1k
R994 VSS ScratchPad_Word2 4.5k
J_A899 N022 N011 0 DR
R995 VDD N022 50k
J_A900 VDD N022 P293 DR
R996 P293 ScratchPad_Word2 1k
R997 VSS ScratchPad_Word2 4.5k
J_A901 N026 N011 0 DR
R998 VDD N026 50k
J_A902 VDD N026 P294 DR
R999 P294 ScratchPad_Word2 1k
R1000 VSS ScratchPad_Word2 4.5k
R1001 VDD 15SPMux3 100k
J_F31 VDD 15SPMux3 P295 DR
R1002 P295 N237 1k
R1003 N237 VSS 4.8k
J_A903 N233 N237 0 DR
R1004 VDD N233 50k
J_A904 VDD N233 P296 DR
R1005 P296 N238 1k
R1006 VSS N238 4.5k
J_F53 P297 N238 0 DR
R1007 VDD 15SPMux2 100k
J_F54 VDD 15SPMux2 P298 DR
R1008 P298 N239 1k
R1009 N239 VSS 4.8k
J_A905 N234 N239 0 DR
R1010 VDD N234 50k
J_A906 VDD N234 P299 DR
R1011 P299 N240 1k
R1012 VSS N240 4.5k
J_F55 P300 N240 0 DR
R1013 VDD 15SPMux1 100k
J_F56 VDD 15SPMux1 P301 DR
R1014 P301 N241 1k
R1015 N241 VSS 4.8k
J_A907 N235 N241 0 DR
R1016 VDD N235 50k
J_A908 VDD N235 P302 DR
R1017 P302 N242 1k
R1018 VSS N242 4.5k
J_F57 P303 N242 0 DR
R1019 VDD 15SPMux0 100k
J_F83 VDD 15SPMux0 P304 DR
R1020 P304 N243 1k
R1021 N243 VSS 4.8k
J_A909 N236 N243 0 DR
R1022 VDD N236 50k
J_A910 VDD N236 P305 DR
R1115 P305 N244 1k
R1116 VSS N244 4.5k
J_F84 P306 N244 0 DR
J_F87 Bus3In Scratch_Outputing P297 DR
J_F88 Bus2In Scratch_Outputing P300 DR
J_F89 Bus1In Scratch_Outputing P303 DR
J_F221 Bus0In Scratch_Outputing P306 DR
J_A911 N245 N237 0 DR
R1117 VDD N245 50k
J_A912 VDD N245 P307 DR
R1118 P307 N238 1k
R1119 VSS N238 4.5k
J_A913 N249 N237 0 DR
R1120 VDD N249 50k
J_A914 VDD N249 P308 DR
R1121 P308 N238 1k
R1122 VSS N238 4.5k
J_A915 N253 N237 0 DR
R1123 VDD N253 50k
J_A916 VDD N253 P309 DR
R1124 P309 N238 1k
R1125 VSS N238 4.5k
J_A917 N257 N237 0 DR
R1126 VDD N257 50k
J_A918 VDD N257 P310 DR
R1127 P310 N238 1k
R1128 VSS N238 4.5k
J_A919 N246 N239 0 DR
R1129 VDD N246 50k
J_A920 VDD N246 P311 DR
R1130 P311 N240 1k
R1131 VSS N240 4.5k
J_A921 N250 N239 0 DR
R1132 VDD N250 50k
J_A922 VDD N250 P312 DR
R1133 P312 N240 1k
R1134 VSS N240 4.5k
J_A923 N254 N239 0 DR
R1135 VDD N254 50k
J_A924 VDD N254 P313 DR
R1136 P313 N240 1k
R1137 VSS N240 4.5k
J_A925 N258 N239 0 DR
R1138 VDD N258 50k
J_A926 VDD N258 P314 DR
R1139 P314 N240 1k
R1140 VSS N240 4.5k
J_A927 N247 N241 0 DR
R1141 VDD N247 50k
J_A928 VDD N247 P315 DR
R1142 P315 N242 1k
R1143 VSS N242 4.5k
J_A929 N251 N241 0 DR
R1144 VDD N251 50k
J_A930 VDD N251 P316 DR
R1145 P316 N242 1k
R1146 VSS N242 4.5k
J_A931 N255 N241 0 DR
R1147 VDD N255 50k
J_A932 VDD N255 P317 DR
R1148 P317 N242 1k
R1149 VSS N242 4.5k
J_A933 N259 N241 0 DR
R1150 VDD N259 50k
J_A934 VDD N259 P318 DR
R1151 P318 N242 1k
R1152 VSS N242 4.5k
J_A935 N248 N243 0 DR
R1153 VDD N248 50k
J_A936 VDD N248 P319 DR
R1154 P319 N244 1k
R1155 VSS N244 4.5k
J_A937 N252 N243 0 DR
R1156 VDD N252 50k
J_A938 VDD N252 P320 DR
R1157 P320 N244 1k
R1158 VSS N244 4.5k
J_A939 N256 N243 0 DR
R1159 VDD N256 50k
J_A940 VDD N256 P321 DR
R1160 P321 N244 1k
R1161 VSS N244 4.5k
J_A941 N260 N243 0 DR
R1162 VDD N260 50k
J_A942 VDD N260 P322 DR
R1163 P322 N244 1k
R1164 VSS N244 4.5k
.model NJF NJF
.model PJF PJF
.lib standard.jft
* Pointer
* Scratch Pad
* PAIR 0
* PAIR 1
.backanno
.end